# EAGLE design BMP085 (EAGLE 5.11)
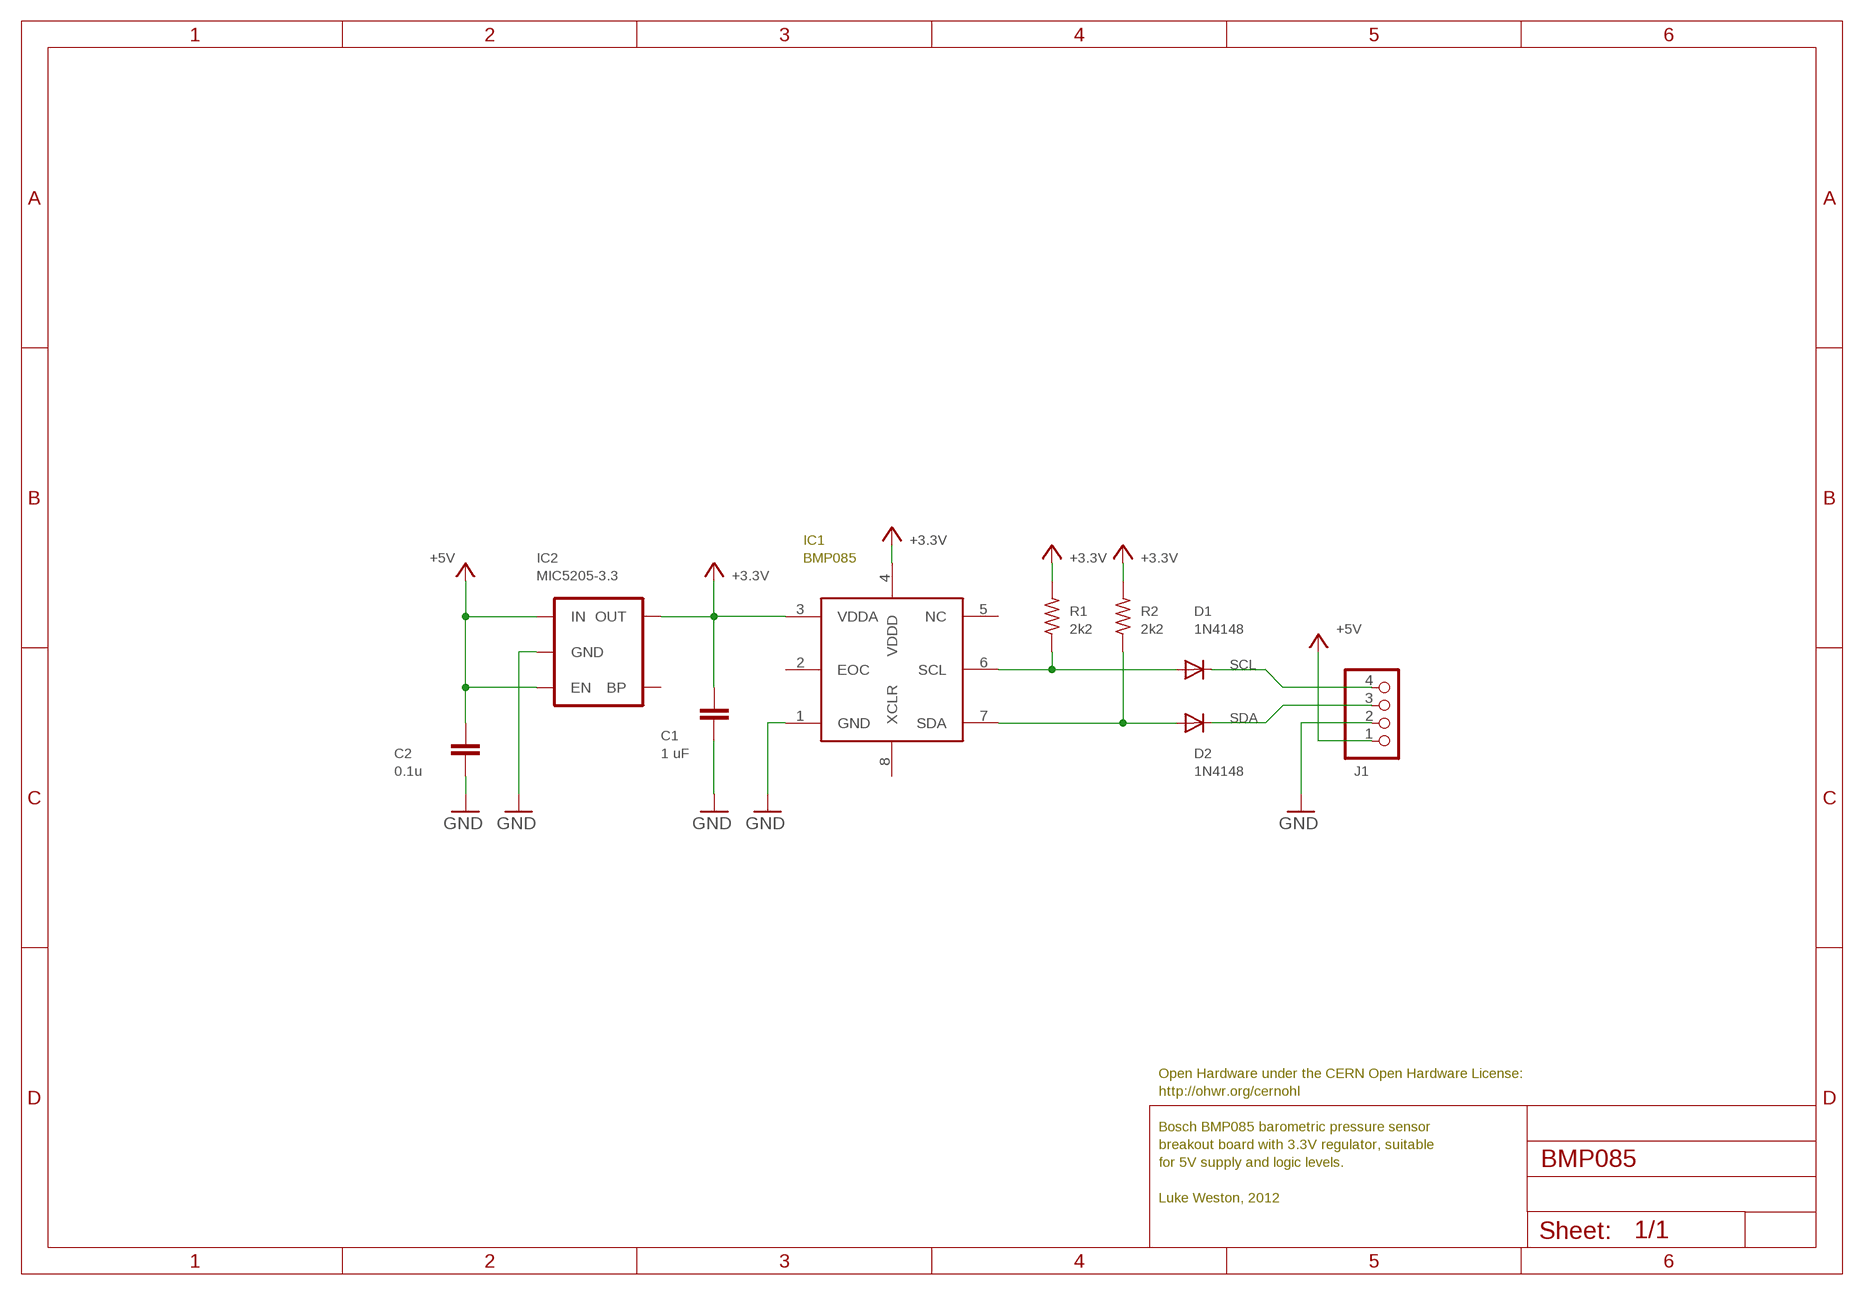
[diagram p0: schematic, sheet 1]

## Parts
C1  1 uF  C-EUC0805K  [C0805K]
C2  0.1u  C-EUC0805K  [C0805K]
D1  1N4148  DIODESOD  [SOD-323]
D2  1N4148  DIODESOD  [SOD-323]
IC1  BMP085  [BMP085]
IC2  MIC5205-3.3  V_REG_LDOSMD  [SOT23-5]
J1  pins  PINHD-1X4  [1X04]
R1  2k2  R-US_M0805  [M0805]
R2  2k2  R-US_M0805  [M0805]

## Nets
+3V3: C1.2 IC1.3(VDDA) IC1.4(VDDD) IC2.5(OUT) R1.2 R2.2 ; supply symbol labelled +3.3V
+5V: C2.2 IC2.1(IN) IC2.3(EN) J1.1
BAR: D2.2(A) IC1.7(SDA) R2.1
FOO: D1.2(A) IC1.6(SCL) R1.1
GND: C1.1 C2.1 IC1.1(GND) IC2.2(GND) J1.2
SCL: D1.1(C) J1.4
SDA: D2.1(C) J1.3
Unconnected: IC1.2(EOC) IC1.5(NC) IC1.8(XCLR) IC2.4(BP)

## Notes on the sheet
- IC1
- BMP085
- Open Hardware under the CERN Open Hardware License:
- http://ohwr.org/cernohl
- Bosch BMP085 barometric pressure sensor
- breakout board with 3.3V regulator, suitable
- for 5V supply and logic levels.
- Luke Weston, 2012

## Library data of the parts
C1 C2 = rcl:C-EU: CAPACITOR, European symbol
D1 D2 = SparkFun:DIODE: Diode These are standard reverse protection diodes and small signal diodes. SMA package can handle up to about 1A. SOD-323 can handle about 200mA. What the SOD-323 package when ordering, there are some mfgs out there that are 5-pin packages.
IC1 = SparkFun:BMP085
IC2 = SparkFun:V_REG_LDO: Voltage Regulator LDO Standard 150mA LDO voltage regulator in SOT-23 layout. Micrel part MIC5205. BP (by-pass) pin is used to lower output noise with 470pF cap.
J1 = pinhead:PINHD-1X4: PIN HEADER
R1 R2 = resistor:R-US_: RESISTOR, American symbol

## Board
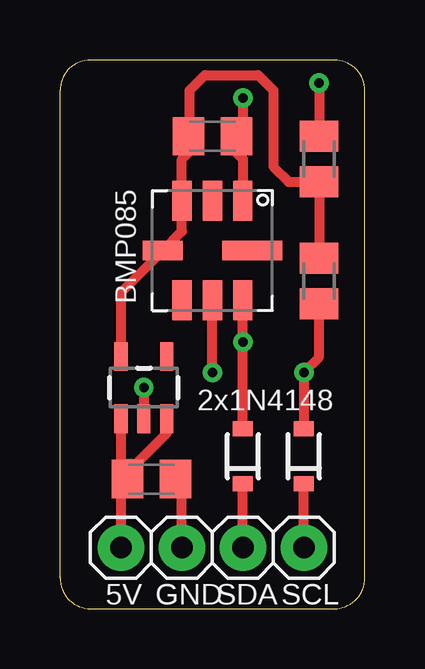
[diagram p1: board, top side]
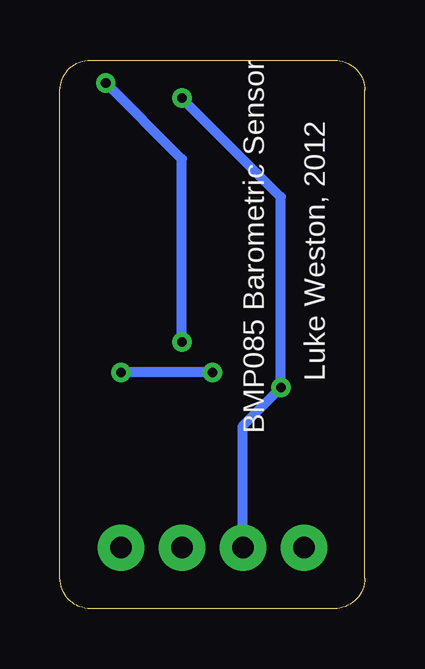
[diagram p2: board, bottom side, seen from below]

Size 12.7 x 22.86 mm. Coordinates in mm from the lower left corner, seen from the top.
Outline: 0,1.27 arc90 1.27,0 11.43,0 arc90 12.7,1.27 12.7,21.59 arc90 11.43,22.86 1.27,22.86 arc90 0,21.59 0,1.27
Copper layers (1*16): Top 0.035mm / dielectric 1.5mm / Bottom 0.035mm
Design rules "freetronics": minimum track width 8mil, minimum drill 15mil, track to track 10mil, track to pad 10mil, pad to pad 10mil, via to via 10mil, smd to smd 8mil, copper to edge 10mil, drill to drill 8mil, minimum pad ring 14mil, minimum via ring 8mil, stop-mask expansion 4mil, vias tented up to drill 25mil, thermal gap 10mil

### Footprints (pad centres in the part's own frame; a part is rotated, then mirrored left to right if it is on the bottom)
C0805K = smd 1.3 x 1.6: 1 -1,0; 2 1,0
SOD-323 = smd 0.63 x 0.83: 1 -1.15,0; 2 1.15,0
BMP085 = smd 1.67 x 0.8: 1 -2.065,1.27; 2 -2.065,0; 3 -2.065,-1.27; 5 2.065,-1.27; 6 2.065,0; 7 2.065,1.27 | smd 0.8 x 1.67: 4 0,-2.065 | smd 0.8 x 2.5: 8 0,1.65
SOT23-5 = smd 0.55 x 1.2: 1 -0.95,-1.3; 2 0,-1.3; 3 0.95,-1.3; 4 0.95,1.3; 5 -0.95,1.3
1X04 = drill 0.9 pad 1.93 round: 1 -3.81,0; 2 -1.27,0; 3 1.27,0; 4 3.81,0
M0805 = smd 1.3 x 1.6: 1 -0.95,0; 2 0.95,0

### Placement (x,y rotation side)
C1  6.35,19.68 180 top
C2  3.81,5.4 180 top
D1  10.16,6.35 90 top
D2  7.62,6.35 90 top
IC1  6.35,14.92 270 top
IC2  3.49,9.21 0 top
J1  6.35,2.54 0 top
R1  10.79,13.65 90 top
R2  10.79,18.73 270 top

### Tracks (layer width: path | path; a pad name or v marks a point on that pad's centre or on a via)
+3V3
  Top 0.406: R1.2 R2.2 9.52,17.78 8.89,18.41 8.89,21.59 8.26,22.23 6.03,22.23 5.4,21.59 5.4,19.73 C1.2 5.35,19 5.08,18.73 IC1.3 5.08,15.72 IC1.4 2.54,13.18 IC2.5
+5V
  Top 0.406: J1.1 2.54,4.13 2.54,5.13 C2.2 2.54,5.66 2.54,6.03 | 2.54,6.03 IC2.1 | IC2.3 4.44,7.3 3.18,6.03 2.54,6.03
BAR  (via drill 0.4)
  Top 0.406: D2.2 v7.62,11.11 IC1.7 | v10.79,21.91 R2.1
  Bottom 0.406: v7.62,11.11 7.62,18.73 v10.79,21.91
FOO  (via drill 0.4)
  Top 0.406: D1.2 v10.16,9.84 10.79,10.48 R1.1 | v6.35,9.84 IC1.6
  Bottom 0.406: v6.35,9.84 v10.16,9.84
GND  (via drill 0.4)
  Top 0.406: v3.49,9.21 IC2.2 | IC1.1 7.62,18.73 7.35,19 C1.1 7.62,19.96 v7.62,21.27 | C2.1 5.08,5.4 J1.2
  Bottom 0.406: J1.2 5.08,7.62 v3.49,9.21 3.49,17.14 v7.62,21.27
SCL
  Top 0.406: J1.4 D1.1
SDA
  Top 0.406: J1.3 D2.1

### Text on the board
tPlace: BMP085 | 2x1N4148 | 5V | GND | SDA | SCL
bPlace: BMP085 Barometric Sensor | Luke Weston, 2012